# Altium schematic sheet 02_Inputs_1-9.SchDoc
size 594 x 420 mm; DocumentNumber: Входы сухой контакт; SheetNumber: 2; SheetTotal: 7
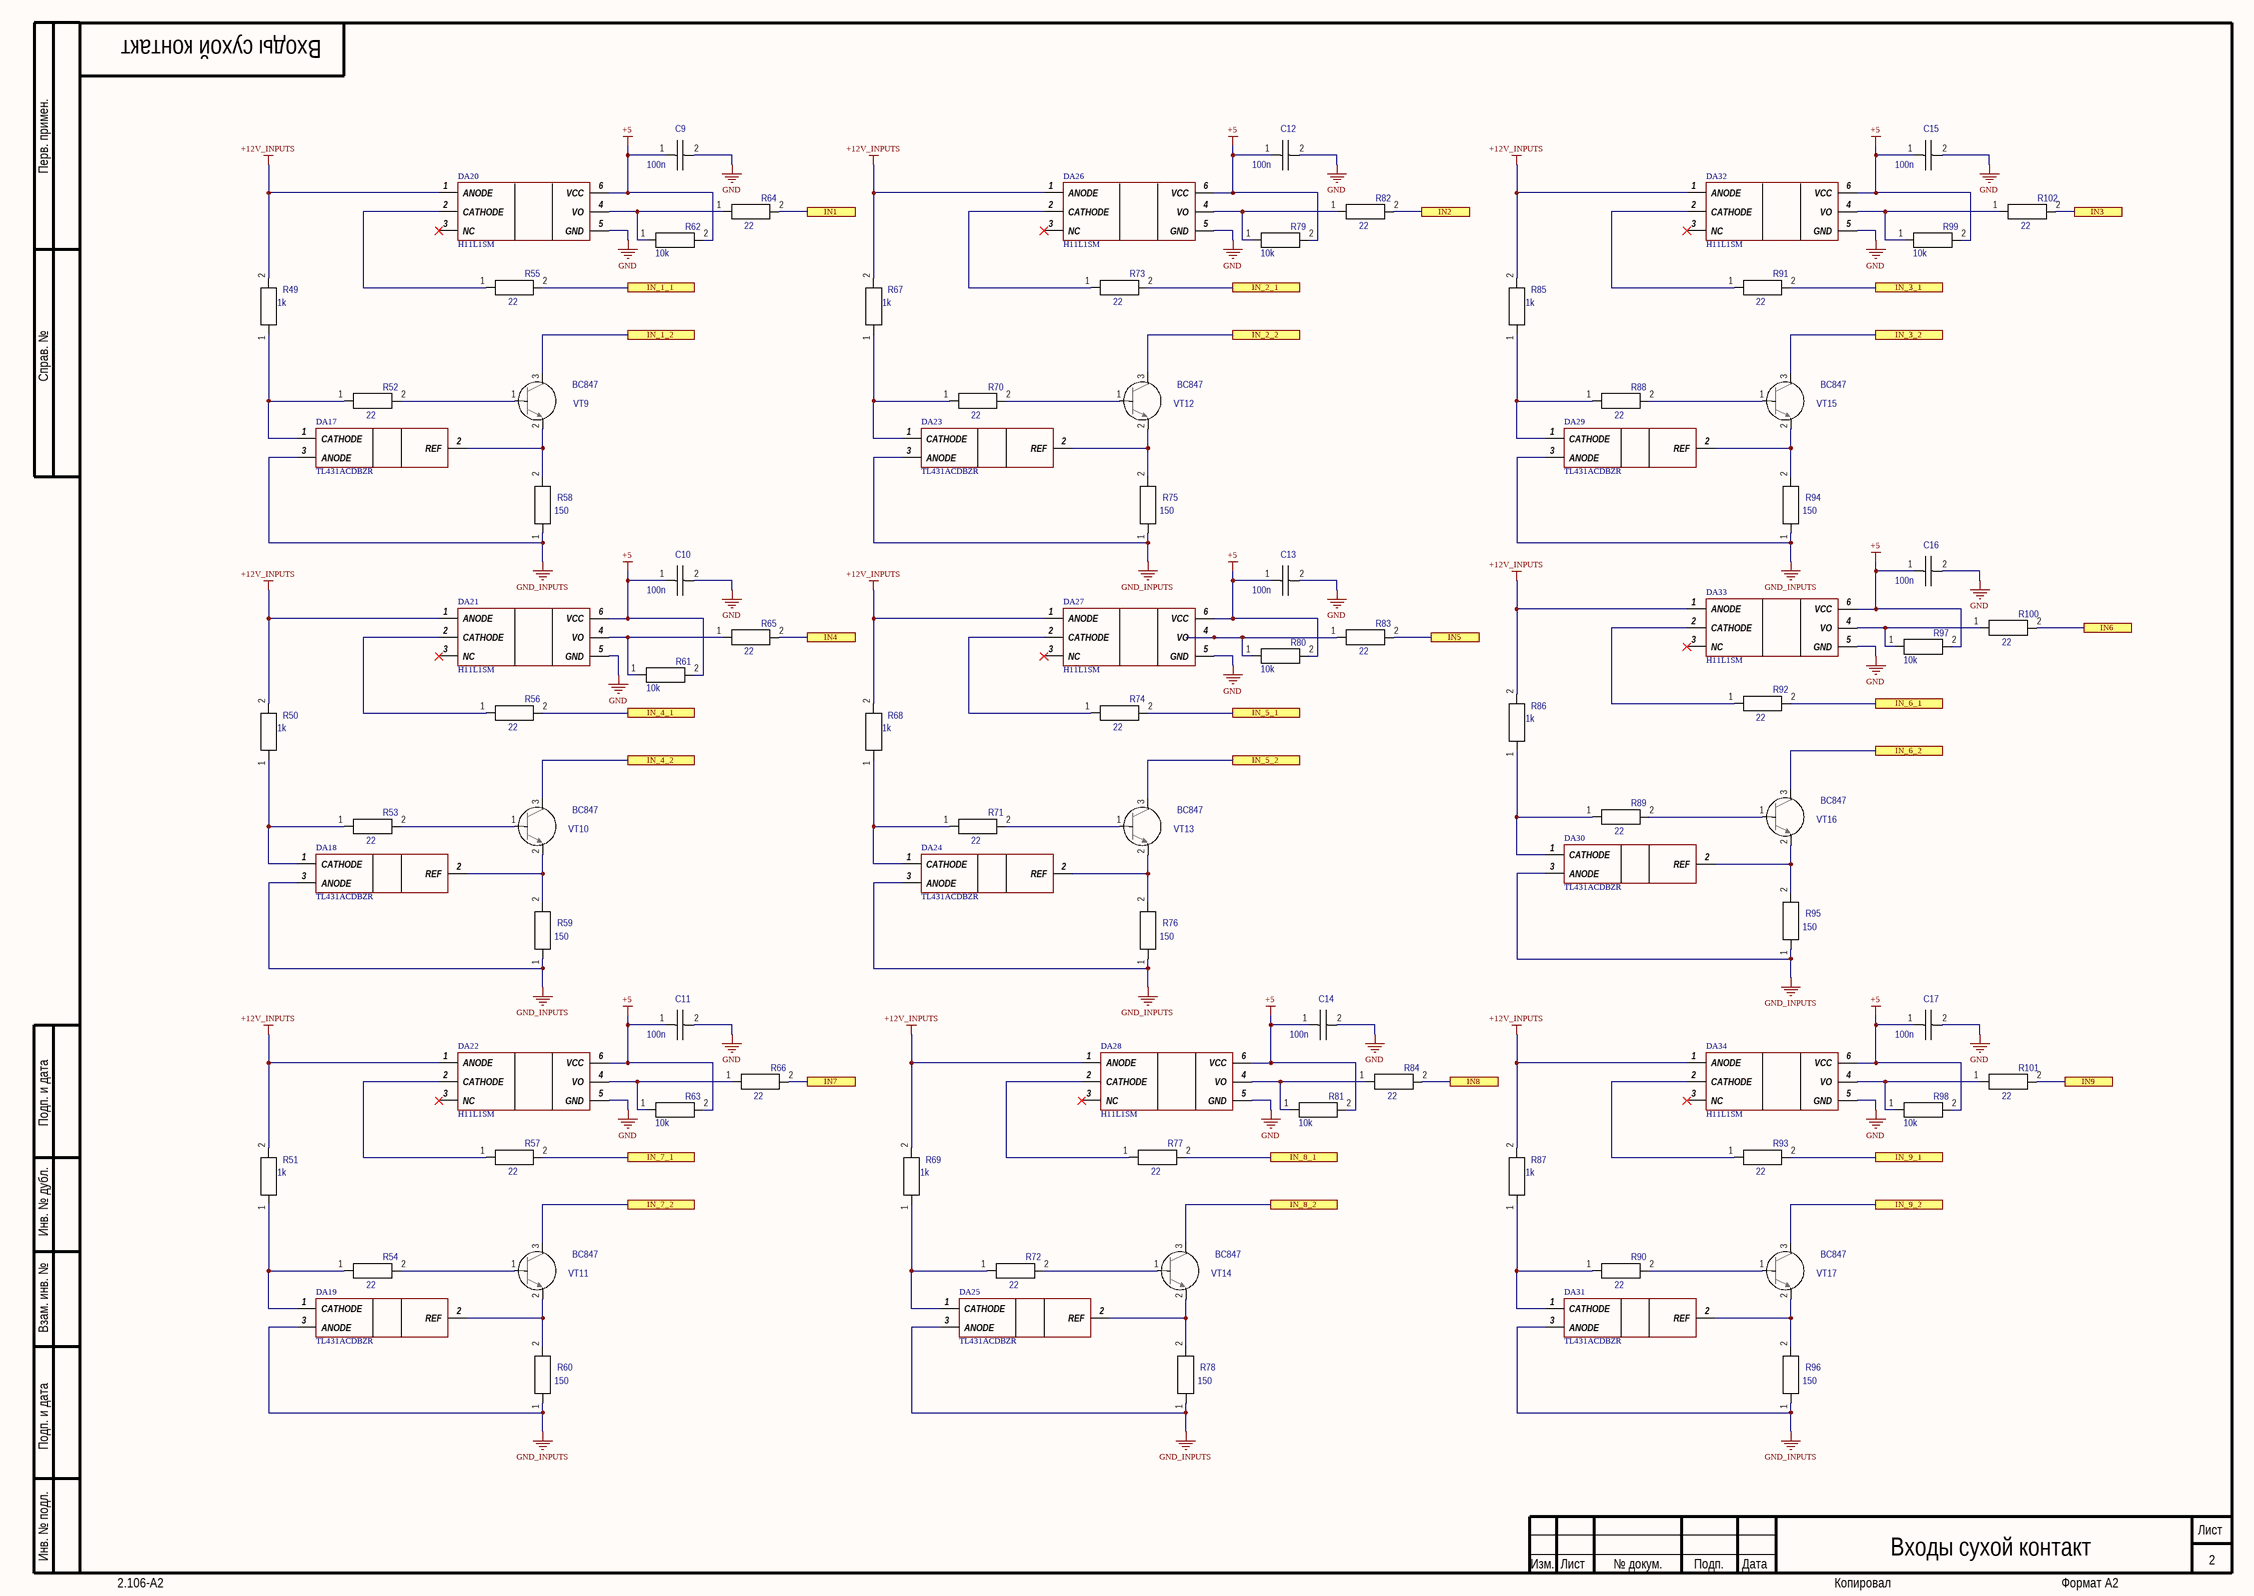
[diagram p0: 02_Inputs_1-9.SchDoc]

## Parts
C9  value 100n  [C0603]  (hidden comment: C0603)
C10  value 100n  [C0603]  (hidden comment: C0603)
C11  value 100n  [C0603]  (hidden comment: C0603)
C12  value 100n  [C0603]  (hidden comment: C0603)
C13  value 100n  [C0603]  (hidden comment: C0603)
C14  value 100n  [C0603]  (hidden comment: C0603)
C15  value 100n  [C0603]  (hidden comment: C0603)
C16  value 100n  [C0603]  (hidden comment: C0603)
C17  value 100n  [C0603]  (hidden comment: C0603)
DA17  TL431ACDBZR  [SOT95P237X112-3N]
DA18  TL431ACDBZR  [SOT95P237X112-3N]
DA19  TL431ACDBZR  [SOT95P237X112-3N]
DA20  H11L1SM  [SOP254P1030X460-6N]
DA21  H11L1SM  [SOP254P1030X460-6N]
DA22  H11L1SM  [SOP254P1030X460-6N]
DA23  TL431ACDBZR  [SOT95P237X112-3N]
DA24  TL431ACDBZR  [SOT95P237X112-3N]
DA25  TL431ACDBZR  [SOT95P237X112-3N]
DA26  H11L1SM  [SOP254P1030X460-6N]
DA27  H11L1SM  [SOP254P1030X460-6N]
DA28  H11L1SM  [SOP254P1030X460-6N]
DA29  TL431ACDBZR  [SOT95P237X112-3N]
DA30  TL431ACDBZR  [SOT95P237X112-3N]
DA31  TL431ACDBZR  [SOT95P237X112-3N]
DA32  H11L1SM  [SOP254P1030X460-6N]
DA33  H11L1SM  [SOP254P1030X460-6N]
DA34  H11L1SM  [SOP254P1030X460-6N]
R49  value 1k  [RESC1608N]  (hidden comment: R0603)
R50  value 1k  [RESC1608N]  (hidden comment: R0603)
R51  value 1k  [RESC1608N]  (hidden comment: R0603)
R52  value 22  [RESC1608N]  (hidden comment: R0603)
R53  value 22  [RESC1608N]  (hidden comment: R0603)
R54  value 22  [RESC1608N]  (hidden comment: R0603)
R55  value 22  [RESC1608N]  (hidden comment: R0603)
R56  value 22  [RESC1608N]  (hidden comment: R0603)
R57  value 22  [RESC1608N]  (hidden comment: R0603)
R58  value 150  [RESC1608N]  (hidden comment: R0603)
R59  value 150  [RESC1608N]  (hidden comment: R0603)
R60  value 150  [RESC1608N]  (hidden comment: R0603)
R61  value 10k  [RESC1608N]  (hidden comment: R0603)
R62  value 10k  [RESC1608N]  (hidden comment: R0603)
R63  value 10k  [RESC1608N]  (hidden comment: R0603)
R64  value 22  [RESC1608N]  (hidden comment: R0603)
R65  value 22  [RESC1608N]  (hidden comment: R0603)
R66  value 22  [RESC1608N]  (hidden comment: R0603)
R67  value 1k  [RESC1608N]  (hidden comment: R0603)
R68  value 1k  [RESC1608N]  (hidden comment: R0603)
R69  value 1k  [RESC1608N]  (hidden comment: R0603)
R70  value 22  [RESC1608N]  (hidden comment: R0603)
R71  value 22  [RESC1608N]  (hidden comment: R0603)
R72  value 22  [RESC1608N]  (hidden comment: R0603)
R73  value 22  [RESC1608N]  (hidden comment: R0603)
R74  value 22  [RESC1608N]  (hidden comment: R0603)
R75  value 150  [RESC1608N]  (hidden comment: R0603)
R76  value 150  [RESC1608N]  (hidden comment: R0603)
R77  value 22  [RESC1608N]  (hidden comment: R0603)
R78  value 150  [RESC1608N]  (hidden comment: R0603)
R79  value 10k  [RESC1608N]  (hidden comment: R0603)
R80  value 10k  [RESC1608N]  (hidden comment: R0603)
R81  value 10k  [RESC1608N]  (hidden comment: R0603)
R82  value 22  [RESC1608N]  (hidden comment: R0603)
R83  value 22  [RESC1608N]  (hidden comment: R0603)
R84  value 22  [RESC1608N]  (hidden comment: R0603)
R85  value 1k  [RESC1608N]  (hidden comment: R0603)
R86  value 1k  [RESC1608N]  (hidden comment: R0603)
R87  value 1k  [RESC1608N]  (hidden comment: R0603)
R88  value 22  [RESC1608N]  (hidden comment: R0603)
R89  value 22  [RESC1608N]  (hidden comment: R0603)
R90  value 22  [RESC1608N]  (hidden comment: R0603)
R91  value 22  [RESC1608N]  (hidden comment: R0603)
R92  value 22  [RESC1608N]  (hidden comment: R0603)
R93  value 22  [RESC1608N]  (hidden comment: R0603)
R94  value 150  [RESC1608N]  (hidden comment: R0603)
R95  value 150  [RESC1608N]  (hidden comment: R0603)
R96  value 150  [RESC1608N]  (hidden comment: R0603)
R97  value 10k  [RESC1608N]  (hidden comment: R0603)
R98  value 10k  [RESC1608N]  (hidden comment: R0603)
R99  value 10k  [RESC1608N]  (hidden comment: R0603)
R100  value 22  [RESC1608N]  (hidden comment: R0603)
R101  value 22  [RESC1608N]  (hidden comment: R0603)
R102  value 22  [RESC1608N]  (hidden comment: R0603)
VT9  BC847  [SOT23-3N]
VT10  BC847  [SOT23-3N]
VT11  BC847  [SOT23-3N]
VT12  BC847  [SOT23-3N]
VT13  BC847  [SOT23-3N]
VT14  BC847  [SOT23-3N]
VT15  BC847  [SOT23-3N]
VT16  BC847  [SOT23-3N]
VT17  BC847  [SOT23-3N]

## Ports
IN1, IN2, IN3, IN4, IN5, IN6, IN7, IN8, IN9, IN_1_1, IN_1_2, IN_2_1, IN_2_2, IN_3_1, IN_3_2, IN_4_1, IN_4_2, IN_5_1, IN_5_2, IN_6_1, IN_6_2, IN_7_1, IN_7_2, IN_8_1, IN_8_2, IN_9_1, IN_9_2

## Nets
+5: C9.1 C10.1 C11.1 C12.1 C13.1 C14.1 C15.1 C16.1 C17.1 DA20.6(VCC) DA21.6(VCC) DA22.6(VCC) DA26.6(VCC) DA27.6(VCC) DA28.6(VCC) DA32.6(VCC) DA33.6(VCC) DA34.6(VCC) R61.2 R62.2 R63.2 R79.2 R80.2 R81.2 R97.2 R98.2 R99.2
+12V_INPUTS: DA20.1(ANODE) DA21.1(ANODE) DA22.1(ANODE) DA26.1(ANODE) DA27.1(ANODE) DA28.1(ANODE) DA32.1(ANODE) DA33.1(ANODE) DA34.1(ANODE) R49.2 R50.2 R51.2 R67.2 R68.2 R69.2 R85.2 R86.2 R87.2
GND: C9.2 C10.2 C11.2 C12.2 C13.2 C14.2 C15.2 C16.2 C17.2 DA20.5(GND) DA21.5(GND) DA22.5(GND) DA26.5(GND) DA27.5(GND) DA28.5(GND) DA32.5(GND) DA33.5(GND) DA34.5(GND)
GND_INPUTS: DA17.3(ANODE) DA18.3(ANODE) DA19.3(ANODE) DA23.3(ANODE) DA24.3(ANODE) DA25.3(ANODE) DA29.3(ANODE) DA30.3(ANODE) DA31.3(ANODE) R58.1 R59.1 R60.1 R75.1 R76.1 R78.1 R94.1 R95.1 R96.1
IN1: R64.2 ; port IN1
IN2: R82.2 ; port IN2
IN3: R102.2 ; port IN3
IN4: R65.2 ; port IN4
IN5: R83.2 ; port IN5
IN6: R100.2 ; port IN6
IN7: R66.2 ; port IN7
IN8: R84.2 ; port IN8
IN9: R101.2 ; port IN9
IN_1_1: R55.2 ; port IN_1_1
IN_1_2: VT9.3 ; port IN_1_2
IN_2_1: R73.2 ; port IN_2_1
IN_2_2: VT12.3 ; port IN_2_2
IN_3_1: R91.2 ; port IN_3_1
IN_3_2: VT15.3 ; port IN_3_2
IN_4_1: R56.2 ; port IN_4_1
IN_4_2: VT10.3 ; port IN_4_2
IN_5_1: R74.2 ; port IN_5_1
IN_5_2: VT13.3 ; port IN_5_2
IN_6_1: R92.2 ; port IN_6_1
IN_6_2: VT16.3 ; port IN_6_2
IN_7_1: R57.2 ; port IN_7_1
IN_7_2: VT11.3 ; port IN_7_2
IN_8_1: R77.2 ; port IN_8_1
IN_8_2: VT14.3 ; port IN_8_2
IN_9_1: R93.2 ; port IN_9_1
IN_9_2: VT17.3 ; port IN_9_2
NetDA17_1: DA17.1(CATHODE) R49.1 R52.1
NetDA17_2: DA17.2(REF) R58.2 VT9.2
NetDA18_1: DA18.1(CATHODE) R50.1 R53.1
NetDA18_2: DA18.2(REF) R59.2 VT10.2
NetDA19_1: DA19.1(CATHODE) R51.1 R54.1
NetDA19_2: DA19.2(REF) R60.2 VT11.2
NetDA20_2: DA20.2(CATHODE) R55.1
NetDA20_4: DA20.4(VO) R62.1 R64.1
NetDA21_2: DA21.2(CATHODE) R56.1
NetDA21_4: DA21.4(VO) R61.1 R65.1
NetDA22_2: DA22.2(CATHODE) R57.1
NetDA22_4: DA22.4(VO) R63.1 R66.1
NetDA23_1: DA23.1(CATHODE) R67.1 R70.1
NetDA23_2: DA23.2(REF) R75.2 VT12.2
NetDA24_1: DA24.1(CATHODE) R68.1 R71.1
NetDA24_2: DA24.2(REF) R76.2 VT13.2
NetDA25_1: DA25.1(CATHODE) R69.1 R72.1
NetDA25_2: DA25.2(REF) R78.2 VT14.2
NetDA26_2: DA26.2(CATHODE) R73.1
NetDA26_4: DA26.4(VO) R79.1 R82.1
NetDA27_2: DA27.2(CATHODE) R74.1
NetDA27_4: DA27.4(VO) R80.1 R83.1
NetDA28_2: DA28.2(CATHODE) R77.1
NetDA28_4: DA28.4(VO) R81.1 R84.1
NetDA29_1: DA29.1(CATHODE) R85.1 R88.1
NetDA29_2: DA29.2(REF) R94.2 VT15.2
NetDA30_1: DA30.1(CATHODE) R86.1 R89.1
NetDA30_2: DA30.2(REF) R95.2 VT16.2
NetDA31_1: DA31.1(CATHODE) R87.1 R90.1
NetDA31_2: DA31.2(REF) R96.2 VT17.2
NetDA32_2: DA32.2(CATHODE) R91.1
NetDA32_4: DA32.4(VO) R99.1 R102.1
NetDA33_2: DA33.2(CATHODE) R92.1
NetDA33_4: DA33.4(VO) R97.1 R100.1
NetDA34_2: DA34.2(CATHODE) R93.1
NetDA34_4: DA34.4(VO) R98.1 R101.1
NetR52_2: R52.2 VT9.1
NetR53_2: R53.2 VT10.1
NetR54_2: R54.2 VT11.1
NetR70_2: R70.2 VT12.1
NetR71_2: R71.2 VT13.1
NetR72_2: R72.2 VT14.1
NetR88_2: R88.2 VT15.1
NetR89_2: R89.2 VT16.1
NetR90_2: R90.2 VT17.1

Not connected (* = marked no-connect by the designer): DA20 3(NC)*; DA21 3(NC)*; DA22 3(NC)*; DA26 3(NC)*; DA27 3(NC)*; DA28 3(NC)*; DA32 3(NC)*; DA33 3(NC)*; DA34 3(NC)*

## Notes on the sheet
- Перв. примен.
- Справ. №
- Подп. и дата
- Инв. № дубл.
- Взам. инв. №
- Инв. № подл.
- Изм.
- Лист
- № докум.
- Подп.
- Дата
- 2.106-A2
- Копировал
- Формат А2

## Library data of the parts
C9-C17 = GRM188R71C104KA01D: Manufacturer: Murata Manufacturing; Код: 22; ID: Конденсатор; Power/Voltage: 16V; Tolerance: ±10%; TKE: X7R; iii: Конденсатор GRM188R71C104KA01D 100n 16V ±10% C0603 X7R  Murata Manufacturing; Comments: C0603; Part Number: GRM188R71C104KA01D; Height: 0.9; Package: C0603; TemperatureMin: -55; TemperatureMax: 125
DA17-DA19 DA23-DA25 DA29-DA31 = TL431ACDBZR: Integrated Circuit; Manufacturer_Name: Texas Instruments; Datasheet Link: https://datasheet.datasheetarchive.com/originals/distributors/SFDatasheet-6/sf-000131849.pdf; Manufacturer_Part_Number: TL431ACDBZR; Mouser Part Number: 595-TL431ACDBZR; Mouser Price/Stock: https://www.mouser.co.uk/ProductDetail/Texas-Instruments/TL431ACDBZR?qs=odmYgEirbwzMcBuFx%2Fo8hQ%3D%3D; Arrow Part Number: TL431ACDBZR; Arrow Price/Stock: https://www.arrow.com/en/products/tl431acdbzr/texas-instruments?region=nac; PartNumber: TL431ACDBZR
DA20-DA22 DA26-DA28 DA32-DA34 = H11L1SM: Integrated Circuit; Manufacturer_Name: Iso Com; Datasheet Link: http://isocom.com/wp-content/uploads/2017/09/DD93224-H11L1_H11L1V-110817.pdf; Height: 4.6mm; Manufacturer_Part_Number: H11L1SM; PartNumber: H11L1SM
R49-R51 R67-R69 R85-R87 = RC0603FK-071KL: Manufacturer: Тайвань; Код: 31; ID: Резистор; Power/Voltage: 0.063W/50V; Tolerance: ±1%; iii: Резистор RC0603FK-071KL 1k 0.063W/50V ±1% R0603  Тайвань; Comments: R0603; Part Number: RC0603FK-071KL; Package: R0603; TemperatureMin: -55; TemperatureMax: 155
R52-R57 R64-R66 R70-R74 R77 R82-R84 R88-R93 R100-R102 = RC0603FK-0722RL: Manufacturer: Тайвань; Код: 11; ID: Резистор; Power/Voltage: 0.063W/50V; Tolerance: ±1%; iii: Резистор RC0603FK-0722RL 22 0.063W/50V ±1% R0603  Тайвань; Comments: R0603; Part Number: RC0603FK-0722RL; Package: R0603; TemperatureMin: -55; TemperatureMax: 155
R58-R60 R75 R76 R78 R94-R96 = RC0603FK-07150RL: Manufacturer: Тайвань; Код: 17; ID: Резистор; Power/Voltage: 0.063W/50V; Tolerance: ±1%; iii: Резистор RC0603FK-07150RL 150 0.063W/50V ±1% R0603  Тайвань; Comments: R0603; Part Number: RC0603FK-07150RL; Package: R0603; TemperatureMin: -55; TemperatureMax: 155
R61-R63 R79-R81 R97-R99 = RC0603FK-0710KL: Part Number: RC0603FR-0710KL; Manufacturer: Тайвань; Код: 26; ID: Резистор; Power/Voltage: 0.063W/50V; Tolerance: ±1%; iii: Резистор RC0603FK-0710KL 10k 0.063W/50V ±1% R0603  Тайвань; Comments: R0603; Package: R0603; TemperatureMin: -55; TemperatureMax: 155
VT9-VT17 = BC847: Manufacturer: NXP Semiconductor; Код: 2; ID: Транзистор; Value: 0.1A; Power/Voltage: 45V; iii: Транзистор BC847 0.1A 45V  sot23  NXP Semiconductor; Com: BC847; Part Number: BC847; Package: sot23